# Altium project project_15.PrjPcb
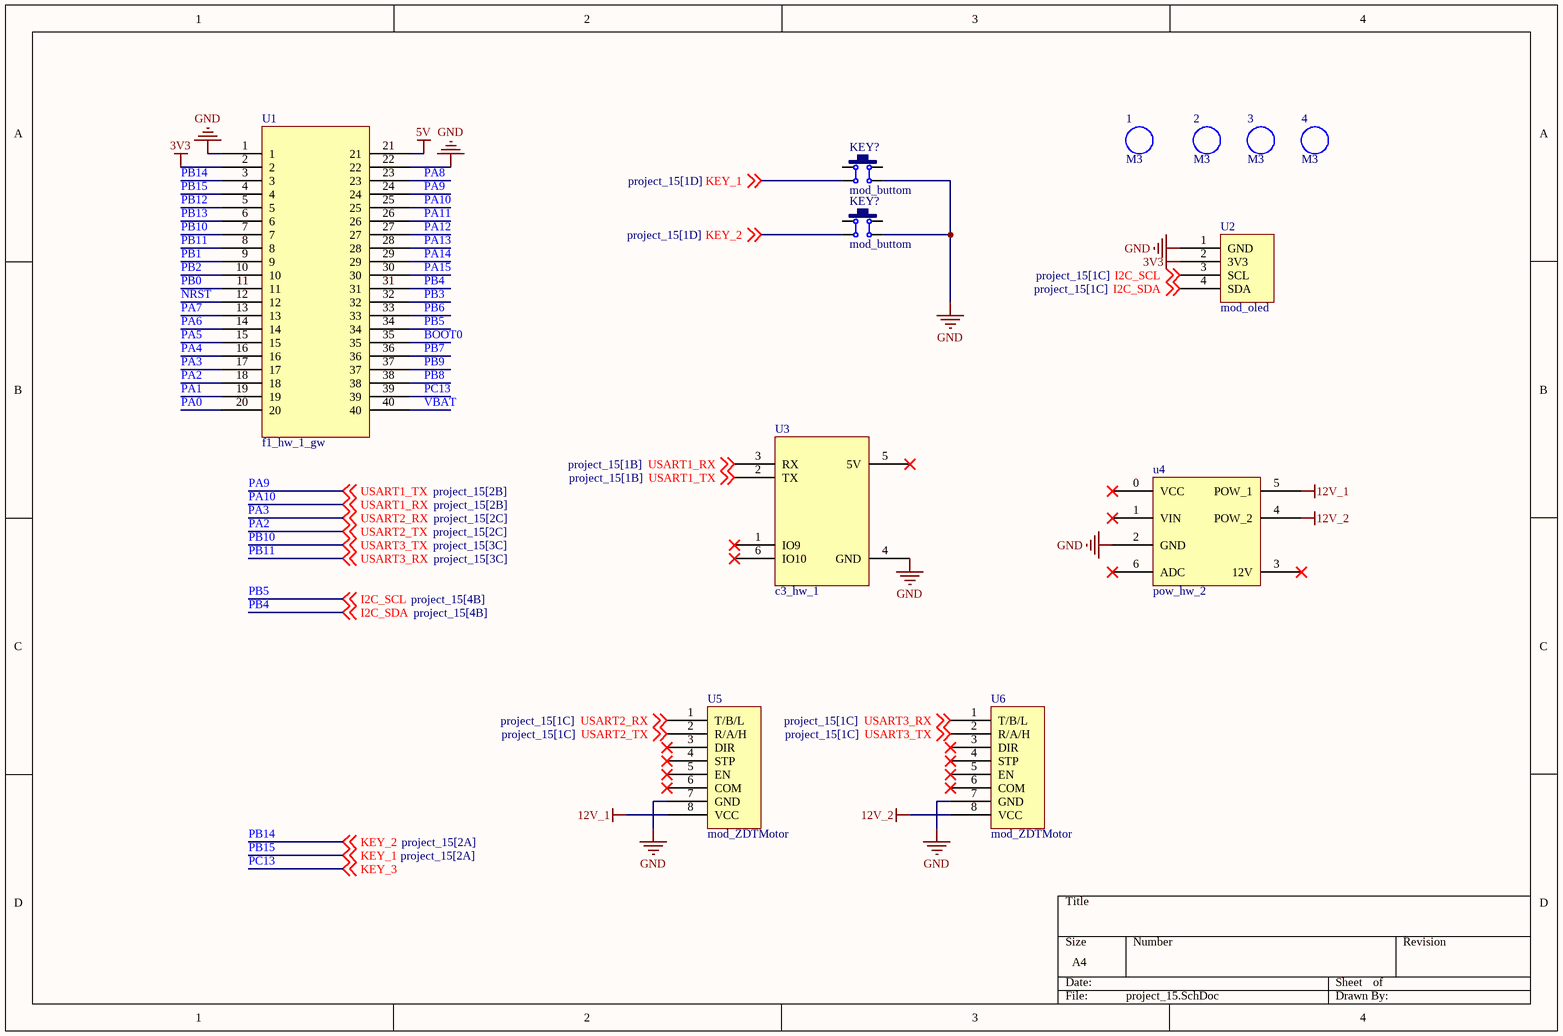
[diagram p0: project_15.SchDoc]
1 sheet, 12 parts. Net scope: global (net labels, ports and power ports of the same name join across sheets).
Board file: project_15.PcbDoc

## Sheet project_15.SchDoc
size A4; SheetNumber: 1; SheetTotal: 1

### Parts
(Parts that share a designator on the sheet are numbered #1, #2 ... from top to bottom, then left to right.)
1  M3  [M3 125X200]
2  M3  [M3 125X200]
3  M3  [M3 125X200]
4  M3  [M3 125X200]
KEY?#1  mod_buttom  [MOD_BUTTOM]
KEY?#2  mod_buttom  [MOD_BUTTOM]
U1  f1_hw_1_gw  [F1_HW_1_GW]
U2  mod_oled  [MOD_OLED]
U3  c3_hw_1  [C3_HW_1]
u4  pow_hw_2  [POW_HW_2]
U5  mod_ZDTMotor  [XH2.54_8P]
U6  mod_ZDTMotor  [XH2.54_8P]

### Nets
3V3: U1.2 U2.2(3V3)
5V: U1.21
12V_1: u4.5(POW_1) U5.8(VCC)
12V_2: u4.4(POW_2) U6.8(VCC)
GND: KEY?#1.3 KEY?#2.3 U1.1 U1.22 U2.1(GND) U3.4(GND) u4.2(GND) U5.7(GND) U6.7(GND)
BOOT0: U1.35
NRST: U1.12
PA0: U1.20
PA1: U1.19
PA2: U1.18 U5.2(R/A/H) ; off-sheet USART2_TX  [also labelled USART2_TX]
PA3: U1.17
PA4: U1.16
PA5: U1.15
PA6: U1.14
PA7: U1.13
PA8: U1.23
PA9: U1.24 U3.2(TX) ; off-sheet USART1_TX  [also labelled USART1_TX]
PA10: U1.25 U3.3(RX) ; off-sheet USART1_RX  [also labelled USART1_RX]
PA11: U1.26
PA12: U1.27
PA13: U1.28
PA14: U1.29
PA15: U1.30
PB0: U1.11
PB1: U1.9
PB2: U1.10
PB3: U1.32
PB4: U1.31 U2.4(SDA) ; off-sheet I2C_SDA  [also labelled I2C_SDA]
PB5: U1.34 U2.3(SCL) ; off-sheet I2C_SCL  [also labelled I2C_SCL]
PB6: U1.33
PB7: U1.36
PB8: U1.38
PB9: U1.37
PB10: U1.7 U6.2(R/A/H) ; off-sheet USART3_TX  [also labelled USART3_TX]
PB11: U1.8 U6.1(T/B/L) ; off-sheet USART3_RX  [also labelled USART3_RX]
PB12: U1.5
PB13: U1.6
PB14: KEY?#2.4 U1.3 ; off-sheet KEY_2  [also labelled KEY_2]
PB15: KEY?#1.4 U1.4 ; off-sheet KEY_1  [also labelled KEY_1]
PC13: U1.39 ; off-sheet KEY_3  [also labelled KEY_3]
USART2_RX: U5.1(T/B/L) ; off-sheet USART2_RX
VBAT: U1.40

Not connected (* = marked no-connect by the designer): KEY?#1 1 2; KEY?#2 1 2; U3 1(IO9)* 5(5V)* 6(IO10)*; u4 0(VCC)* 1(VIN)* 3(12V)* 6(ADC)*; U5 3(DIR)* 4(STP)* 5(EN)* 6(COM)*; U6 3(DIR)* 4(STP)* 5(EN)* 6(COM)*

### Notes on the sheet
- Labels drawn without touching a wire or pin: PA3

### Library data of the parts
1-4 = prot_m3: m3铜柱孔; BOM名称: 铜柱孔; 版权归属: 源创客; 学习资源: www.ooocke.com
KEY?#1 KEY?#2 = mod_buttom: 6*6*4.3按键
U2 = mod_oled: oled模块 / 4p排母
U3 = c3_hw_1: ESP32C3蓝牙模块 / 6p排母
u4 = pow_hw_2: 两路升降压电源模块 / 6p排母*2
U5 U6 = mod_ZDTMotor: 闭环步进,10-29V